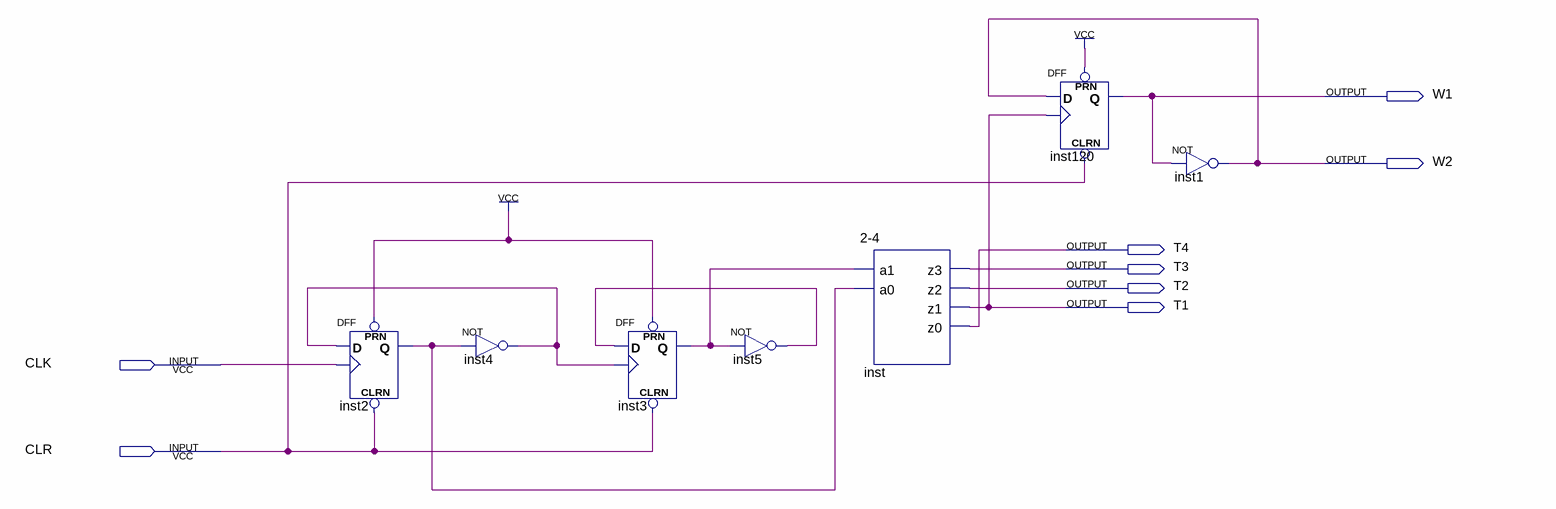
[diagram p0: schematic sheet]
// Quartus schematic Beat.bdf as structural Verilog: 7 symbols, 8 pins
module Beat (
  input  CLK,
  input  CLR,
  output W1,
  output W2,
  output T4,
  output T3,
  output T2,
  output T1
);

  wire inst2_q, inst3_q, inst4_out, inst5_out;

  DFF inst2 (.CLRN(CLR), .CLK(CLK), .D(inst4_out), .PRN(1'b1), .Q(inst2_q));
  not inst4 (inst4_out, inst2_q);
  DFF inst3 (.CLRN(CLR), .CLK(inst4_out), .D(inst5_out), .PRN(1'b1), .Q(inst3_q));
  not inst5 (inst5_out, inst3_q);
  \2-4  inst (.a1(inst3_q), .a0(inst2_q), .z3(T3), .z2(T2), .z1(T1), .z0(T4));
  DFF inst120 (.CLRN(CLR), .CLK(T1), .D(W2), .PRN(1'b1), .Q(W1));
  not inst1 (W2, W1);
endmodule
